# Altium schematic sheet Cover_Page.SchDoc
size 420 x 297 mm; CompanyName: Septentrio; Organization: Designed By ANAVS; Address1: Septentrio; Address2: Interleuvenlaan 15i; Address3: 3001 Leuven; Address4: Belgium; SheetNumber: 1; SheetTotal: 3
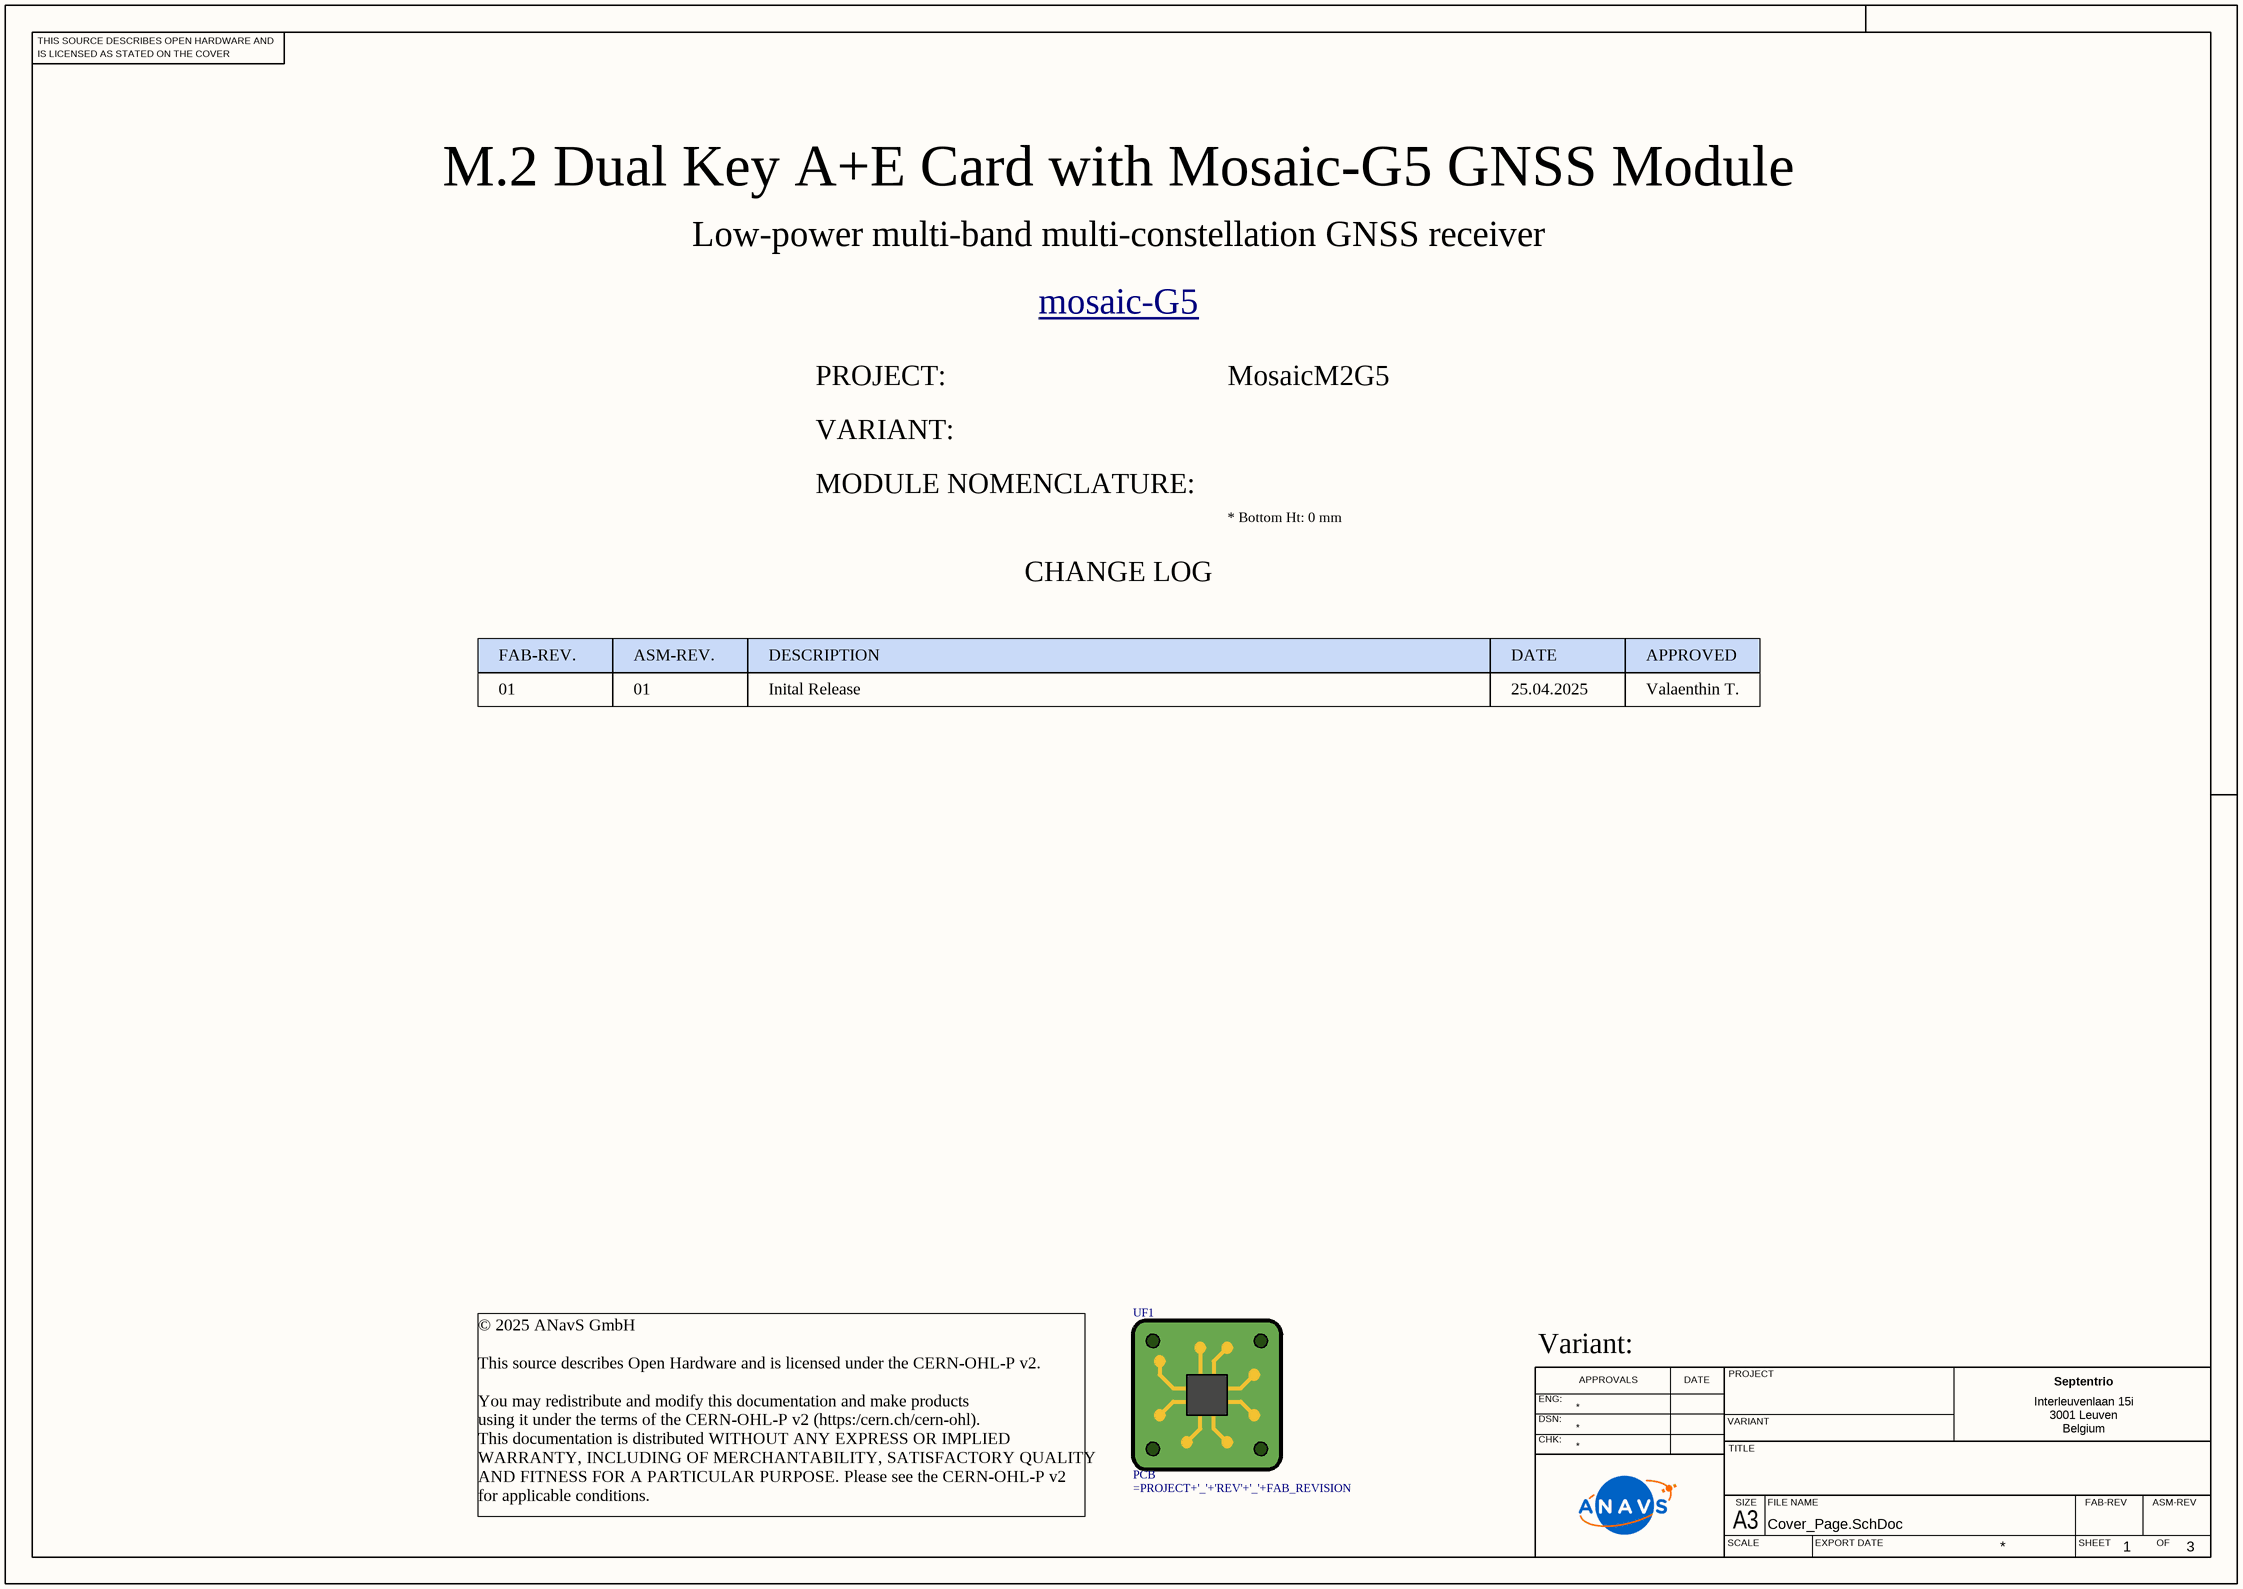
[diagram p0: Cover_Page.SchDoc]

## Parts
UF1  PCB  (mechanical)

## Notes on the sheet
- M.2 Dual Key A+E Card with Mosaic-G5 GNSS Module
- Low-power multi-band multi-constellation GNSS receiver
- mosaic-G5 <https://www.septentrio.com/en/septentrio-extends-its-mosaic-family>
- PROJECT:
- MosaicM2G5
- VARIANT:
- MODULE NOMENCLATURE:
- * Bottom Ht: 0 mm
- CHANGE LOG
- FAB-REV.
- ASM-REV.
- DESCRIPTION
- DATE
- APPROVED
- 01
- Inital Release
- 25.04.2025
- Valaenthin T.
- Variant:
- © 2025 ANavS GmbH
  This source describes Open Hardware and is licensed under the CERN-OHL-P v2.
  You may redistribute and modify this documentation and make products
  using it under the terms of the CERN-OHL-P v2 (https:/cern.ch/cern-ohl).
  This documentation is distributed WITHOUT ANY EXPRESS OR IMPLIED
  WARRANTY, INCLUDING OF MERCHANTABILITY, SATISFACTORY QUALITY
  AND FITNESS FOR A PARTICULAR PURPOSE. Please see the CERN-OHL-P v2
  for applicable conditions.
- THIS SOURCE DESCRIBES OPEN HARDWARE AND
- IS LICENSED AS STATED ON THE COVER
- ENG:
- APPROVALS
- PROJECT
- DSN:
- CHK:
- VARIANT
- TITLE
- SCALE
- A3
- SIZE
- FILE NAME
- EXPORT DATE
- SHEET
- FAB-REV
- ASM-REV
- OF

## Library data of the parts
UF1 = CMP-00001-7: Printed Circuit Board; Value: =PROJECT+'_'+'REV'+'_'+FAB_REVISION